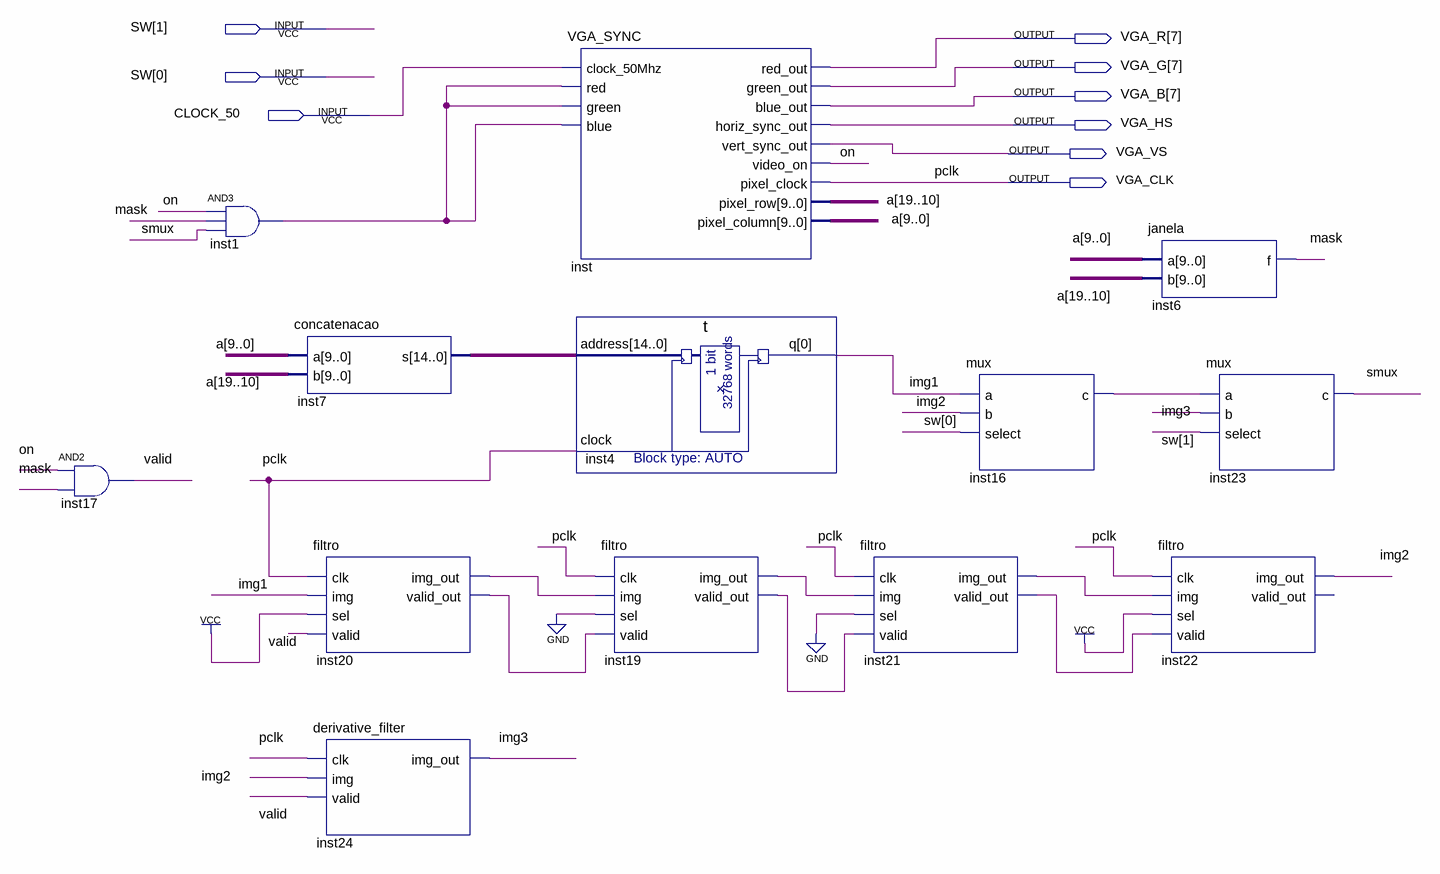
[diagram p0: schematic sheet]
// Quartus schematic Filtro-3.bdf as structural Verilog: 13 symbols, 9 pins
module \Filtro-3  (
  input  [1:0] SW,
  input  CLOCK_50,
  output [7:7] VGA_R,
  output [7:7] VGA_G,
  output [7:7] VGA_B,
  output VGA_HS,
  output VGA_VS,
  output VGA_CLK
);

  wire img1, img2, img3, inst1_out, inst16_c, inst19_img_out, inst19_valid_out, inst20_img_out,
       inst20_valid_out, inst21_img_out, inst21_valid_out, mask, on, smux, valid;
  wire [14:0] inst7_s;
  wire [19:0] a;

  and inst17 (valid, on, mask);
  and inst1 (inst1_out, on, mask, smux);
  concatenacao inst7 (.a(a[9:0]), .b(a[19:10]), .s(inst7_s));
  filtro inst20 (
    .clk(VGA_CLK), .img(img1), .sel(1'b1), .valid(valid), .img_out(inst20_img_out),
    .valid_out(inst20_valid_out));
  derivative_filter inst24 (.clk(VGA_CLK), .img(img2), .valid(valid), .img_out(img3));
  VGA_SYNC inst (
    .clock_50Mhz(CLOCK_50), .red(inst1_out), .green(inst1_out), .blue(inst1_out), .red_out(VGA_R[7]),
    .green_out(VGA_G[7]), .blue_out(VGA_B[7]), .horiz_sync_out(VGA_HS), .vert_sync_out(VGA_VS),
    .video_on(on), .pixel_clock(VGA_CLK), .pixel_row(a[19:10]), .pixel_column(a[9:0]));
  t inst4 (.address(inst7_s), .clock(VGA_CLK), .q(img1));
  filtro inst19 (
    .clk(VGA_CLK), .img(inst20_img_out), .sel(1'b0), .valid(inst20_valid_out), .img_out(inst19_img_out),
    .valid_out(inst19_valid_out));
  filtro inst21 (
    .clk(VGA_CLK), .img(inst19_img_out), .sel(1'b0), .valid(inst19_valid_out), .img_out(inst21_img_out),
    .valid_out(inst21_valid_out));
  mux inst16 (.a(img1), .b(img2), .select(SW[0]), .c(inst16_c));
  janela inst6 (.a(a[9:0]), .b(a[19:10]), .f(mask));
  filtro inst22 (
    .clk(VGA_CLK), .img(inst21_img_out), .sel(1'b1), .valid(inst21_valid_out), .img_out(img2));  // open: valid_out
  mux inst23 (.a(inst16_c), .b(img3), .select(SW[1]), .c(smux));

  // Other names for the same wires on the sheet: pclk = VGA_CLK
endmodule
